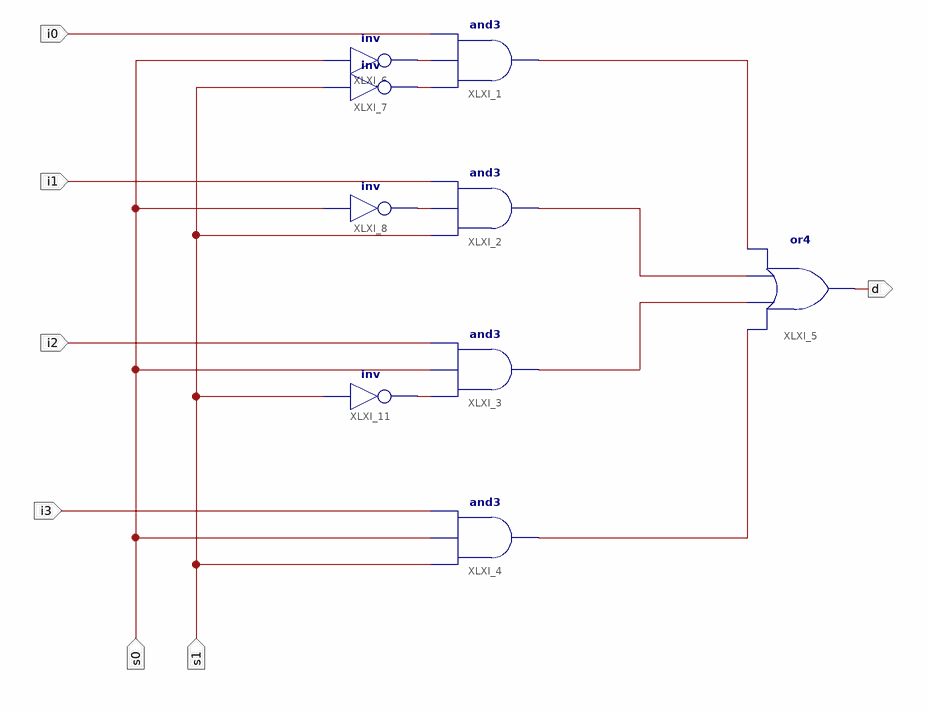
[diagram p0: schematic sheet 1]
// Xilinx ISE schematic fourtoonemultiplexer.sch (spartan3e) as structural Verilog: 9 symbols, 7 ports
module fourtoonemultiplexer (
  input  i0,
  input  i1,
  input  i2,
  input  i3,
  input  s0,
  input  s1,
  output d
);

  wire XLXN_2, XLXN_3, XLXN_4, XLXN_5, XLXN_12, XLXN_13, XLXN_14, XLXN_15;

  and XLXI_1 (XLXN_2, XLXN_13, XLXN_12, i0);
  and XLXI_2 (XLXN_3, s1, XLXN_14, i1);
  and XLXI_3 (XLXN_4, XLXN_15, s0, i2);
  and XLXI_4 (XLXN_5, s1, s0, i3);
  or XLXI_5 (d, XLXN_5, XLXN_4, XLXN_3, XLXN_2);
  not XLXI_6 (XLXN_12, s0);
  not XLXI_7 (XLXN_13, s1);
  not XLXI_8 (XLXN_14, s0);
  not XLXI_11 (XLXN_15, s1);
endmodule
